# Altium schematic sheet FRONT-UNIT-7.SCHDOC: FRONT-UNIT-7INCH
size A2; DocumentNumber: 1; Revision: 2.0; SheetNumber: 1; SheetTotal: 18; DocumentName: Лист 1.SCHDOC
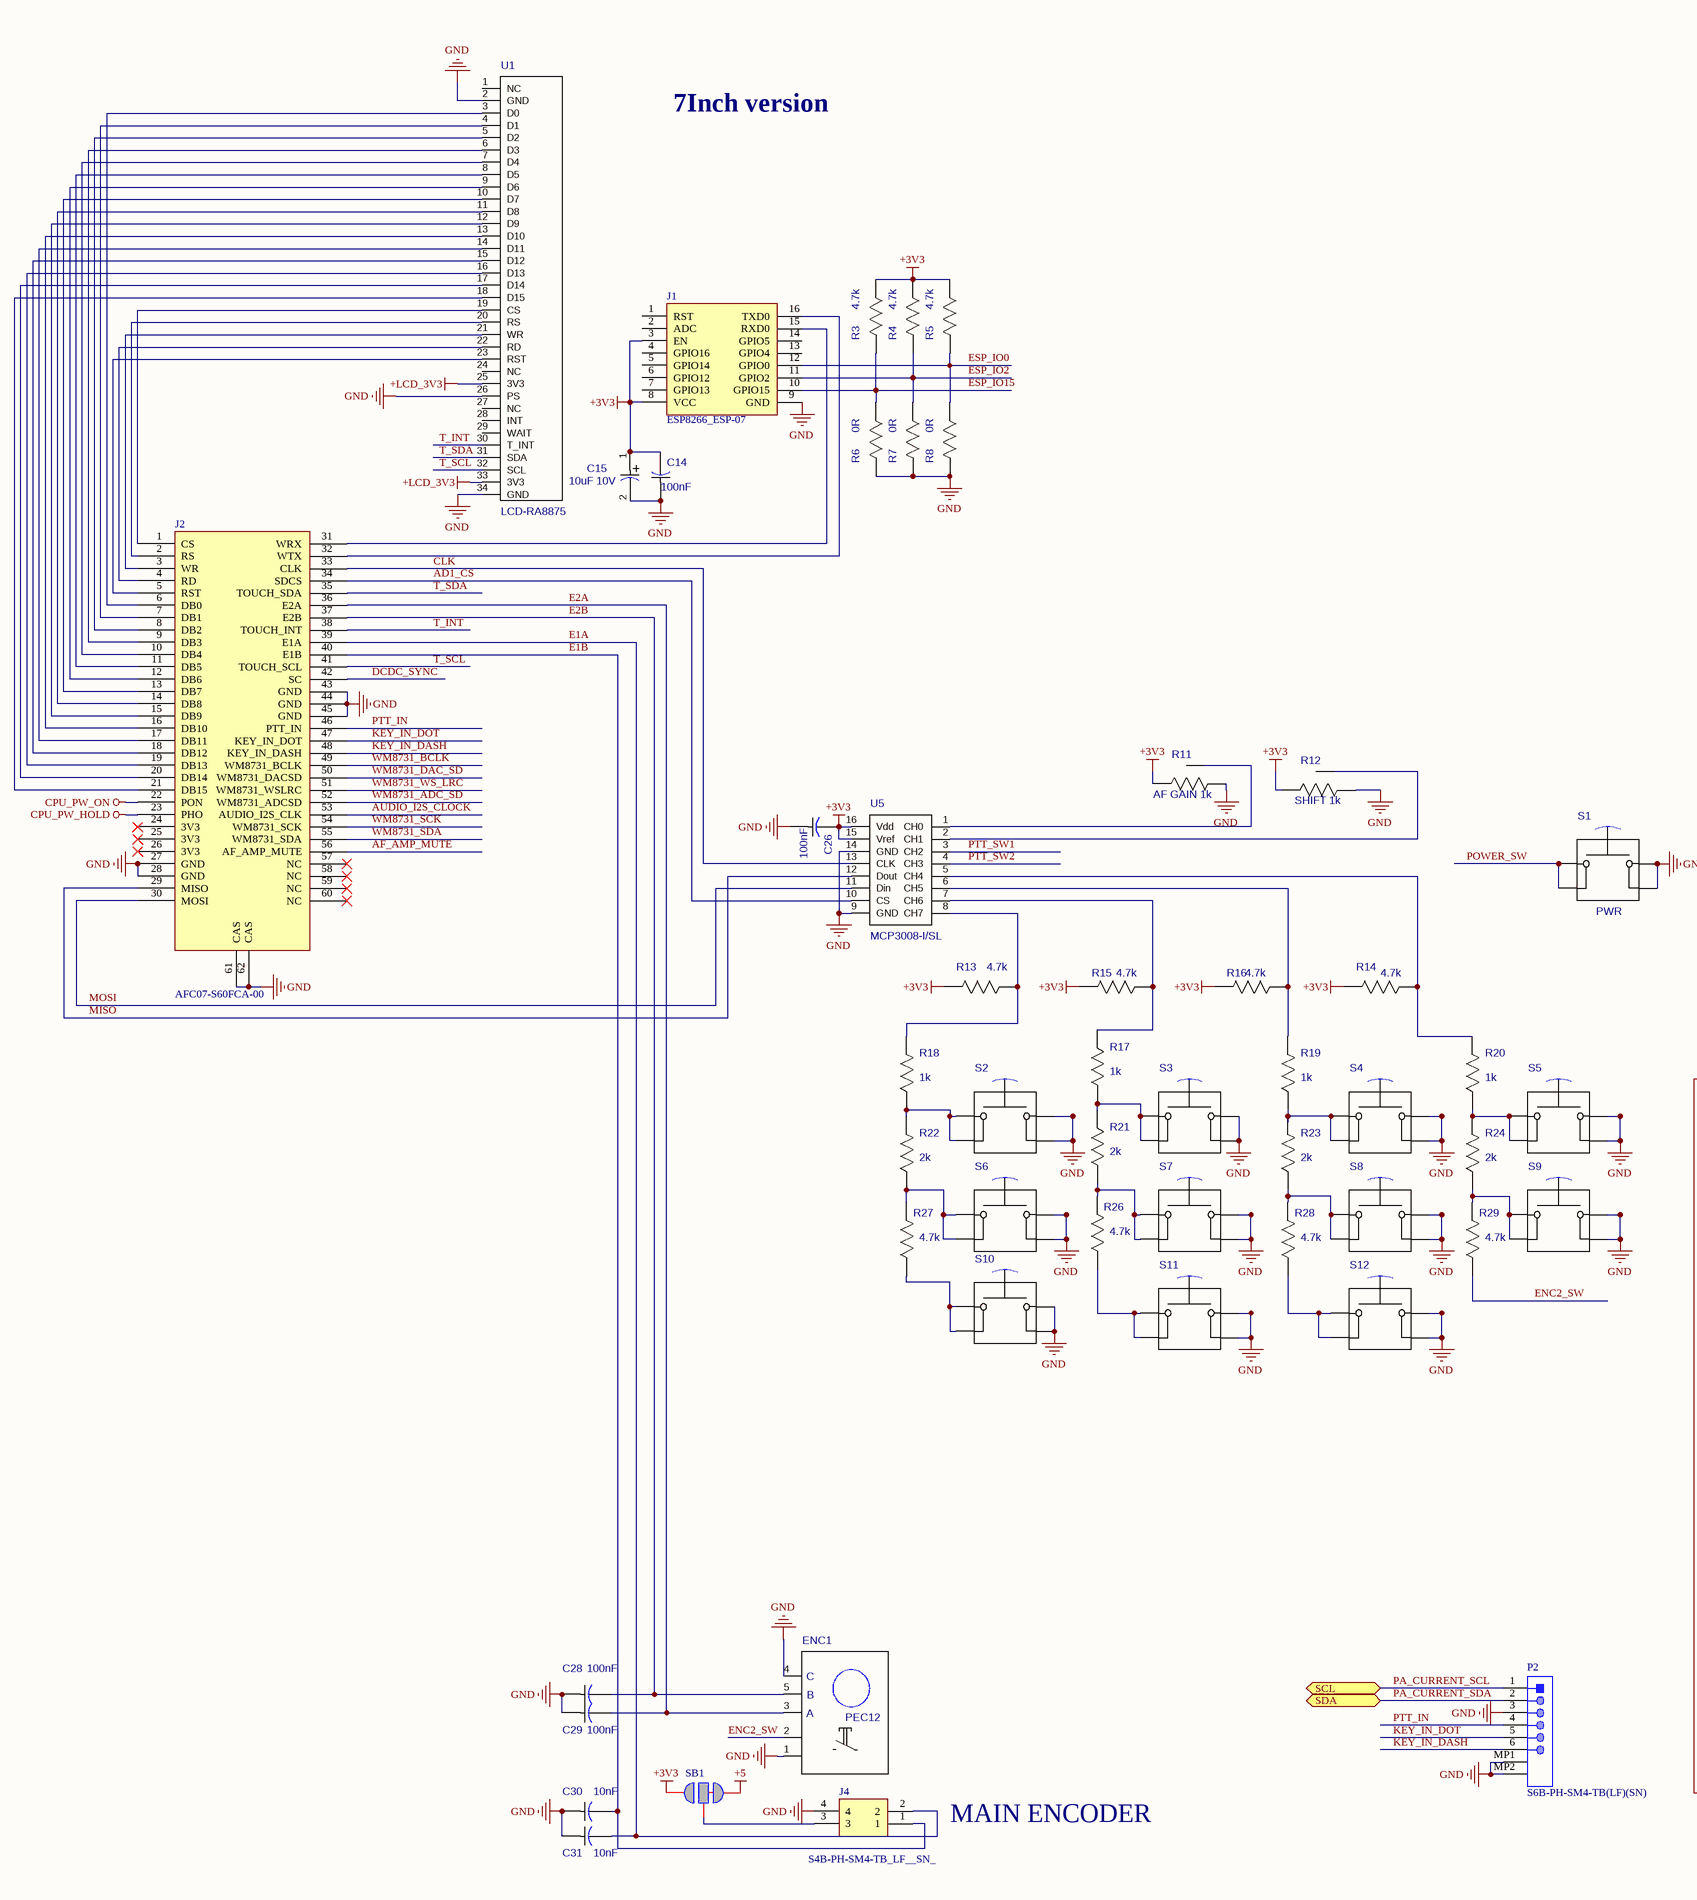
[diagram p0: FRONT-UNIT-7.SCHDOC, left]
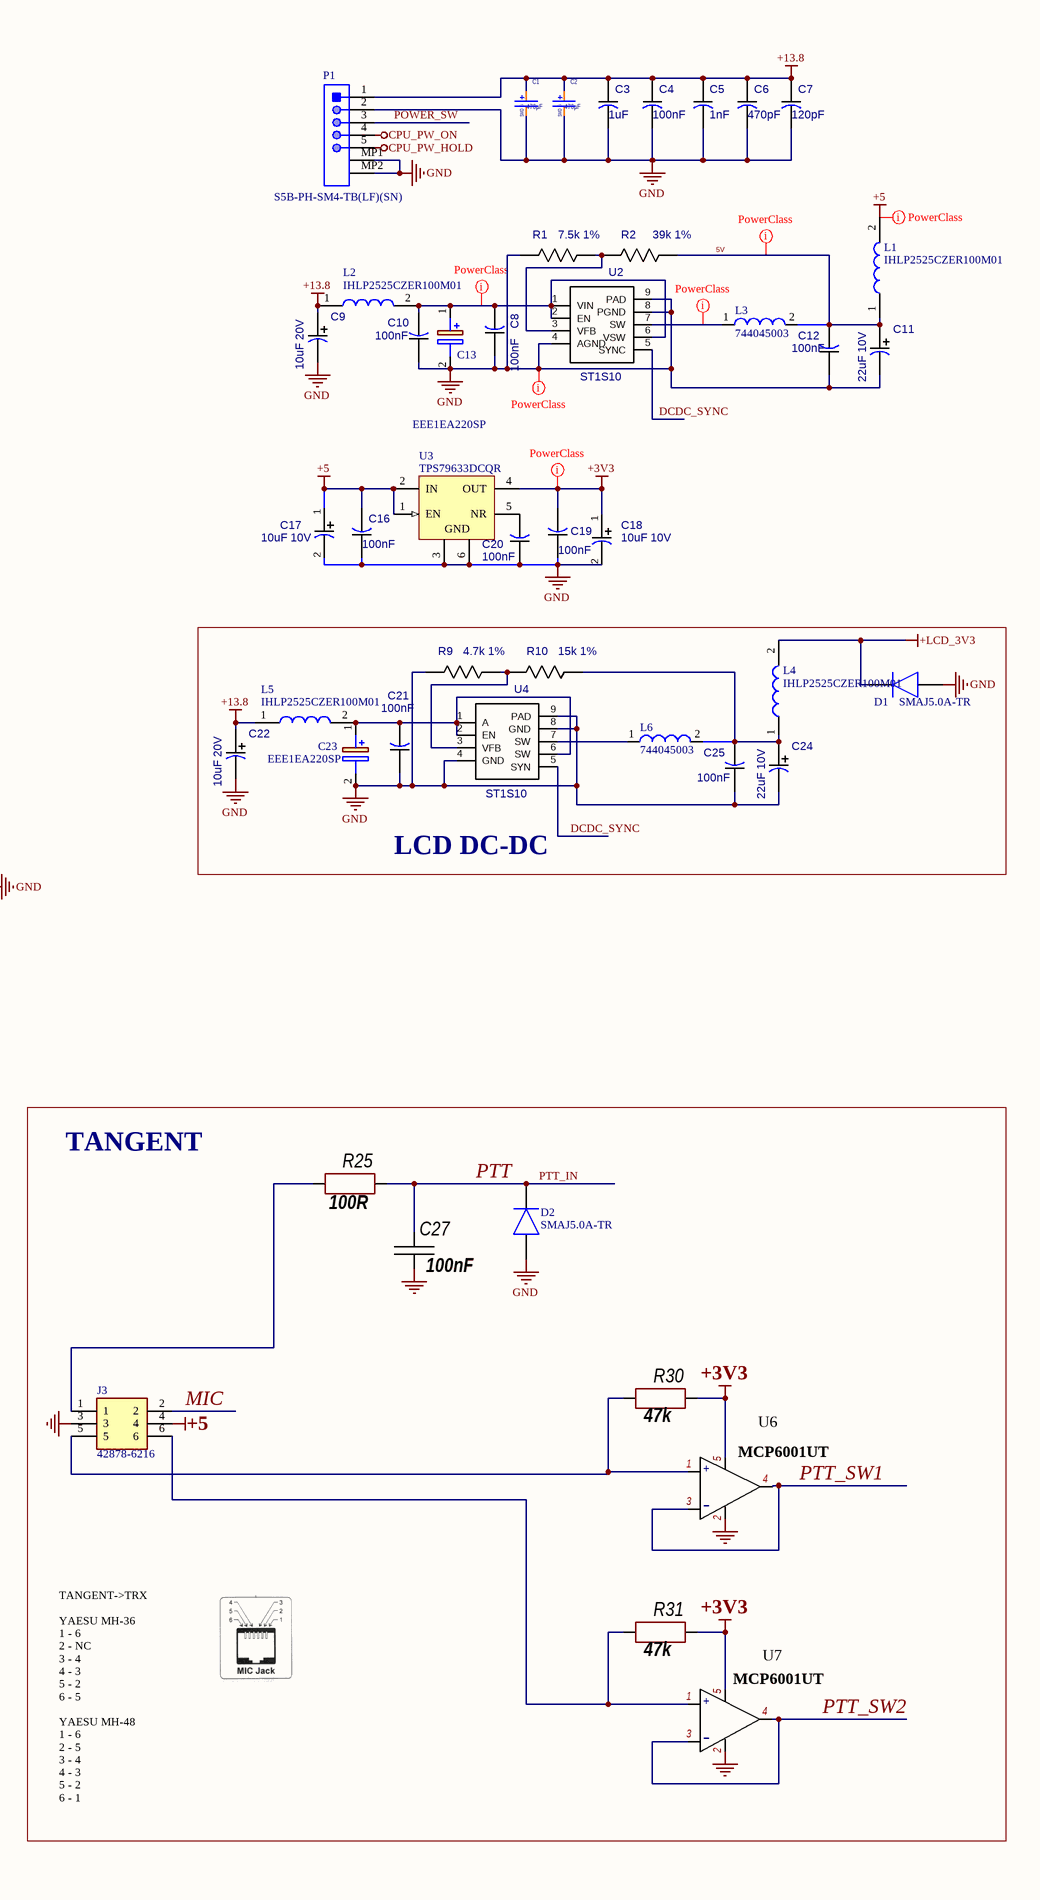
[diagram p1: FRONT-UNIT-7.SCHDOC, right]

## Parts
C1  value 470µF  [SMD-G-10X10.2]  (hidden comment: 470uF 25V)
C2  value 470µF  [SMD-G-10X10.2]  (hidden comment: 470uF 25V)
C3  1uF  [CAP_1206]
C4  100nF  [CAP_1206]
C5  1nF  [CAP_1206]
C6  470pF  [CAP_1206]
C7  120pF  [CAP_1206]
C8  100nF  [CAP_0805]
C9  10uF 20V  [CAPAE_4.3x4.3h5.4]
C10  100nF  [CAP_0805]
C11  22uF 10V  [CAPAE_4.3x4.3h5.4]
C12  100nF  [CAP_0805]
C13  EEE1EA220SP  [EEE1AA101SP]
C14  100nF  [CAP_0805]
C15  10uF 10V  [CAPAE_4.3x4.3h5.4]
C16  100nF  [CAP_0805]
C17  10uF 10V  [CAPAE_4.3x4.3h5.4]
C18  10uF 10V  [CAPAE_4.3x4.3h5.4]
C19  100nF  [CAP_0805]
C20  100nF  [CAP_0805]
C21  100nF  [CAP_0805]
C22  10uF 20V  [CAPAE_4.3x4.3h5.4]
C23  EEE1EA220SP  [EEE1AA101SP]
C24  22uF 10V  [CAPAE_4.3x4.3h5.4]
C25  100nF  [CAP_0805]
C26  100nF  [CAP_0805]
C27  100nF  [CH0805C]
C28  100nF  [CAP_0805]
C29  100nF  [CAP_0805]
C30  10nF  [CAP_0805]
C31  10nF  [CAP_0805]
D1  SMAJ5.0A-TR  [SMBJ36CATR]
D2  SMAJ5.0A-TR  [SMBJ36CATR]
ENC1  PEC12  [PEC12]
J1  ESP8266_ESP-07  [ESP8266ESP07]
J2  AFC07-S60FCA-00  [AFC07-S60FCA-00]
J3  42878-6216  [428786216]
J4  S4B-PH-SM4-TB_LF__SN_  [S4B-PH-SM4-TB]
L1  IHLP2525CZER100M01  [INDPM6965X300N]
L2  IHLP2525CZER100M01  [INDPM6965X300N]
L3  744045003  [WE-LQ-L]
L4  IHLP2525CZER100M01  [INDPM6965X300N]
L5  IHLP2525CZER100M01  [INDPM6965X300N]
L6  744045003  [WE-LQ-L]
P1  S5B-PH-SM4-TB(LF)(SN)  [JST-S5B-PH-SM4-TB_V]
P2  S6B-PH-SM4-TB(LF)(SN)  [JST-S6B-PH-SM4-TB(LF)(SN)_V]
R1  7.5k 1%  [RES_0805]
R2  39k 1%  [RES_0805]
R3  4.7k  [RES_0805]
R4  4.7k  [RES_0805]
R5  4.7k  [RES_0805]
R6  0R  [RES_0805]
R7  0R  [RES_0805]
R8  0R  [RES_0805]
R9  4.7k 1%  [RES_0805]
R10  15k 1%  [RES_0805]
R11  value AF GAIN 1k  [PTV09]  (hidden comment: PTV09A-4030F-A102)
R12  value SHIFT 1k  [PTV09]  (hidden comment: PTV09A-4030F-A102)
R13  4.7k  [RES_0805]
R14  4.7k  [RES_0805]
R15  4.7k  [RES_0805]
R16  4.7k  [RES_0805]
R17  1k  [RES_0805]
R18  1k  [RES_0805]
R19  1k  [RES_0805]
R20  1k  [RES_0805]
R21  2k  [RES_0805]
R22  2k  [RES_0805]
R23  2k  [RES_0805]
R24  2k  [RES_0805]
R25  100R  [CH0805R]
R26  4.7k  [RES_0805]
R27  4.7k  [RES_0805]
R28  4.7k  [RES_0805]
R29  4.7k  [RES_0805]
R30  47k  [CH0805R]
R31  47k  [CH0805C]
S1  value PWR  [PTS645SK50LFS]  (hidden comment: PTS645SK50LFS)
S2  PTS645SK50LFS  [PTS645SK50LFS]  (value not drawn)
S3  PTS645SK50LFS  [PTS645SK50LFS]  (value not drawn)
S4  PTS645SK50LFS  [PTS645SK50LFS]  (value not drawn)
S5  PTS645SK50LFS  [PTS645SK50LFS]  (value not drawn)
S6  PTS645SK50LFS  [PTS645SK50LFS]  (value not drawn)
S7  PTS645SK50LFS  [PTS645SK50LFS]  (value not drawn)
S8  PTS645SK50LFS  [PTS645SK50LFS]  (value not drawn)
S9  PTS645SK50LFS  [PTS645SK50LFS]  (value not drawn)
S10  PTS645SK50LFS  [PTS645SK50LFS]  (value not drawn)
S11  PTS645SK50LFS  [PTS645SK50LFS]  (value not drawn)
S12  PTS645SK50LFS  [PTS645SK50LFS]  (value not drawn)
SB1  Jumper_open_short  [PCBJumperOpenShort]  (value not drawn)  (net tie, no BOM)
U1  LCD-RA8875  [LCD-RA8875]
U2  ST1S10  [ST1S10]
U3  TPS79633DCQR  [DCQ0006A_L]
U4  ST1S10  [ST1S10]
U5  MCP3008-I/SL  [MCP3008-I/SL]
U6  MCP6001UT  [SOT23-5]
U7  MCP6001UT  [SOT23-5]

## Blocks framed on the sheet
LCD DC-DC: C21-C25 D1 L4-L6 R9 R10 U4
TANGENT: C27 D2 J3 R25 R30 R31 U6 U7

## Ports
SCL (bidir), SDA (bidir)

## Nets
+3V3: C14.2 C15.1(PLUS) C18.1(PLUS) C19.2 C26.2 J1.3(EN) J1.8(VCC) R3.1 R4.1 R5.1 R11.1(CW) R12.1(CW) R13.2 R14.2 R15.2 R16.2 R30.2 R31.2 SB1.2 U3.4(OUT) U5.15(Vref) U5.16(Vdd) U6.5 U7.5
+5: C16.2 C17.1(PLUS) J3.4 L1.2 SB1.1 U3.1(EN) U3.2(IN)
+13.8: C1.1 C2.1 C3.1 C4.1 C5.1 C6.1 C7.1 C9.1(PLUS) C22.1(PLUS) L2.1 L5.1 P1.1
+LCD_3V3: D1.1(K) L4.2 U1.25(3V3) U1.33(3V3)
CPU_PW_HOLD: J2.23(PHO) P1.5
CPU_PW_ON: J2.22(PON) P1.4
GND: C1.2 C2.2 C3.2 C4.2 C5.2 C6.2 C7.2 C8.1 C9.2(MINUS) C10.1 C11.2(MINUS) C12.1 C13.2(-) C14.1 C15.2(MINUS) C16.1 C17.2(MINUS) C18.2(MINUS) C19.1 C20.1 C21.1 C22.2(MINUS) C23.2(-) C24.2(MINUS) C25.1 C26.1 C27.1 C28.1 C29.1 C30.1 C31.1 D1.2(A) D2.2(A) ENC1.1 ENC1.4(C) J1.9(GND) J2.27(GND) J2.28(GND) J2.43(GND) J2.44(GND) J2.45(GND) J2.61(CAS) J2.62(CAS) J3.3 J4.4 P1.2 P1.MP1 P1.MP2 P2.3 P2.MP1 P2.MP2 R1.1 R6.2 R7.2 R8.2 R9.1 R11.3(CCW) R12.3(CCW) S1.3(B) S1.4(B) S2.3(B) S2.4(B) S3.3(B) S3.4(B) S4.3(B) S4.4(B) S5.3(B) S5.4(B) S6.3(B) S6.4(B) S7.3(B) S7.4(B) S8.3(B) S8.4(B) S9.3(B) S9.4(B) S10.3(B) S10.4(B) S11.3(B) S11.4(B) S12.3(B) S12.4(B) U1.2(GND) U1.26(PS) U1.34(GND) U2.4(AGND) U2.8(PGND) U2.9(PAD) U3.3(GND) U3.6(GND) U4.4(GND) U4.8(GND) U4.9(PAD) U5.9(GND) U5.14(GND) U6.2 U7.2
5V: C11.1(PLUS) C12.2 L1.1 L3.2 R2.2
AD1_CS: J2.34(SDCS) U5.10(CS)
AF_AMP_MUTE: J2.56(AF_AMP_MUTE)
AUDIO_I2S_CLOCK: J2.53(AUDIO_I2S_CLK)
CLK: J2.33(CLK) U5.13(CLK)
DCDC_SYNC: J2.42(SC) U2.5(SYNC) U4.5(SYN)
E1A: C31.2 J2.39(E1A) J4.2
E1B: C30.2 J2.40(E1B) J4.1
E2A: C29.2 ENC1.3(A) J2.36(E2A)
E2B: C28.2 ENC1.5(B) J2.37(E2B)
ENC2_SW: ENC1.2 R29.1
ESP_IO0: J1.12(GPIO0) R5.2 R8.1
ESP_IO2: J1.11(GPIO2) R4.2 R7.1
ESP_IO15: J1.10(GPIO15) R3.2 R6.1
KEY_IN_DASH: J2.48(KEY_IN_DASH) P2.6
KEY_IN_DOT: J2.47(KEY_IN_DOT) P2.5
MIC: J3.2
MISO: J2.29(MISO) U5.12(Dout)
MOSI: J2.30(MOSI) U5.11(Din)
PA_CURRENT_SCL: P2.1 ; port SCL
PA_CURRENT_SDA: P2.2 ; port SDA
POWER_SW: P1.3 S1.1(A) S1.2(A)
PTT: C27.2 D2.1(K) J2.46(PTT_IN) P2.4 R25.2  [also labelled PTT_IN]
PTT_SW1: U5.3(CH2) U6.3 U6.4
PTT_SW2: U5.4(CH3) U7.3 U7.4
T_INT: J2.38(TOUCH_INT) U1.30(T_INT)
T_SCL: J2.41(TOUCH_SCL) U1.32(SCL)
T_SDA: J2.35(TOUCH_SDA) U1.31(SDA)
WM8731_ADC_SD: J2.52(WM8731_ADCSD)
WM8731_BCLK: J2.49(WM8731_BCLK)
WM8731_DAC_SD: J2.50(WM8731_DACSD)
WM8731_SCK: J2.54(WM8731_SCK)
WM8731_SDA: J2.55(WM8731_SDA)
WM8731_WS_LRC: J2.51(WM8731_WSLRC)
NetC8_2: C8.2 C10.2 C13.1(+) L2.2 U2.1(VIN) U2.2(EN) U2.6(VSW)
NetC20_2: C20.2 U3.5(NR)
NetC21_2: C21.2 C23.1(+) L5.2 U4.1(A) U4.2(EN) U4.6(SW)
NetC24_1: C24.1(PLUS) C25.2 L4.1 L6.2 R10.2
NetJ1_15: J1.15(RXD0) J2.31(WRX)
NetJ1_16: J1.16(TXD0) J2.32(WTX)
NetJ2_1: J2.1(CS) U1.19(CS)
NetJ2_2: J2.2(RS) U1.20(RS)
NetJ2_3: J2.3(WR) U1.21(WR)
NetJ2_4: J2.4(RD) U1.22(RD)
NetJ2_5: J2.5(RST) U1.23(RST)
NetJ2_6: J2.6(DB0) U1.3(D0)
NetJ2_7: J2.7(DB1) U1.4(D1)
NetJ2_8: J2.8(DB2) U1.5(D2)
NetJ2_9: J2.9(DB3) U1.6(D3)
NetJ2_10: J2.10(DB4) U1.7(D4)
NetJ2_11: J2.11(DB5) U1.8(D5)
NetJ2_12: J2.12(DB6) U1.9(D6)
NetJ2_13: J2.13(DB7) U1.10(D7)
NetJ2_14: J2.14(DB8) U1.11(D8)
NetJ2_15: J2.15(DB9) U1.12(D9)
NetJ2_16: J2.16(DB10) U1.13(D10)
NetJ2_17: J2.17(DB11) U1.14(D11)
NetJ2_18: J2.18(DB12) U1.15(D12)
NetJ2_19: J2.19(DB13) U1.16(D13)
NetJ2_20: J2.20(DB14) U1.17(D14)
NetJ2_21: J2.21(DB15) U1.18(D15)
NetJ3_1: J3.1 R25.1
NetJ3_5: J3.5 R30.1 U6.1
NetJ3_6: J3.6 R31.1 U7.1
NetJ4_3: J4.3 SB1.3
NetL3_1: L3.1 U2.7(SW)
NetL6_1: L6.1 U4.7(SW)
NetR1_2: R1.2 R2.1 U2.3(VFB)
NetR9_2: R9.2 R10.1 U4.3(VFB)
NetR11_2: R11.2(W) U5.1(CH0)
NetR12_2: R12.2(W) U5.2(CH1)
NetR13_1: R13.1 R18.2 U5.8(CH7)
NetR14_1: R14.1 R20.2 U5.5(CH4)
NetR15_1: R15.1 R17.2 U5.7(CH6)
NetR16_1: R16.1 R19.2 U5.6(CH5)
NetR17_1: R17.1 R21.2 S3.1(A) S3.2(A)
NetR18_1: R18.1 R22.2 S2.1(A) S2.2(A)
NetR19_1: R19.1 R23.2 S4.1(A) S4.2(A)
NetR20_1: R20.1 R24.2 S5.1(A) S5.2(A)
NetR21_1: R21.1 R26.2 S7.1(A) S7.2(A)
NetR22_1: R22.1 R27.2 S6.1(A) S6.2(A)
NetR23_1: R23.1 R28.2 S8.1(A) S8.2(A)
NetR24_1: R24.1 R29.2 S9.1(A) S9.2(A)
NetR26_1: R26.1 S11.1(A) S11.2(A)
NetR27_1: R27.1 S10.1(A) S10.2(A)
NetR28_1: R28.1 S12.1(A) S12.2(A)

Not connected (* = marked no-connect by the designer): J1 1(RST) 2(ADC) 4(GPIO16) 5(GPIO14) 6(GPIO12) 7(GPIO13) 13(GPIO4) 14(GPIO5); J2 24(3V3)* 25(3V3)* 26(3V3)* 57(NC)* 58(NC)* 59(NC)* 60(NC)*; U1 1(NC) 24(NC) 27(NC) 28(INT) 29(WAIT)

## Layout directives
net class PowerPads: 5V, +3V3, +5, GND, NetC8_2, NetL3_1

## Notes on the sheet
- 7Inch version
- TANGENT->TRX
  YAESU MH-36
  1 - 6
  2 - NC
  3 - 4
  4 - 3
  5 - 2
  6 - 5
  YAESU MH-48
  1 - 6
  2 - 5
  3 - 4
  4 - 3
  5 - 2
  6 - 1
- MAIN ENCODER
- Title
- Size:
- Date:
- File:
- A2
- Number:
- Time:
- Revision:
- Sheet
- of
- (in symbol MCP6001UT_1) +; -
- (in symbol SMD-G 470uF 25V) SMD G

## Library data of the parts
C1 C2 = SMD-G 470uF 25V: CAP ALUM 470UF 20% 25V SMD; Manufacturer: KEMET; Manufacturer PartNumber: EDH477M025A9PAA; Pricing Аlternative: 0.05; Temp.Characteristic: –55 °C to +105 °C; Note: Aluminum Electrolytic Capacitors; Detailed Description: 470µF 25V Aluminum Electrolytic Capacitors Radial, Can - SMD  2000 Hrs @ 105°C; Lifetime @ Temp: 2000Hrs@105℃; ComponentLink2URL: http://www.mouser.com/ds/2/315/ABA0000C1181-947564.pdf; Dealer Digi-Key: https://www.digikey.com/product-detail/en/kemet/EDH477M025A9PAA/EDH477M025A9PAA-ND/6597660; Dealer Аlternative: https://detail.1688.com/offer/541866342432.html; Package / Case: G, 0.394" Dia (10.00mm); Pricing Digi-Key: 0.21; Publisher: Catcatcat Electronics; Tolerance: ±20 %; Voltage: 25V; HelpURL: https://api.kemet.com/component-edge/download/datasheet/EDH477M025A9PAA.pdf; website developer: http://catcatcat.d-lan.dp.ua/; PartNumber Digi-Key: EDH477M025A9PAA; Assembly type: Manual Part
C3-C7 = CAP_1206
  C3: Value: 1uF
  C4: Value: 100nF
  C5: Value: 1nF
C8 C10 C12 C14 C16 C19-C21 C25 C26 C28-C31 = CAP_0805
  C8 C10 C12 C14 C16 C19-C21 C25 C26 C28 C29: Value: 100nF
C9 C11 C15 C17 C18 C22 C24 = CAPAE_4.3x4.3h5.4
  C9 C22: Value: 10uF 20V
  C11 C24: Value: 22uF 10V
  C15 C17 C18: Value: 10uF 10V
C13 C23 = EEE1EA220SP: Capacitor Polarised; Manufacturer_Name: Panasonic; Datasheet Link: http://industrial.panasonic.com/cdbs/www-data/pdf/RDE0000/ABA0000C1145.pdf; Height: 7.8mm; Manufacturer_Part_Number: EEE1EA220SP
C27 = Capacitor: Manufacturer: *; Model: *; HelpURL: *; ComponentKind: *; Value: *
D1 D2 = SMLVT3V3: Diode; Manufacturer_Name: STMicroelectronics; Allied_Number: 70013736; Datasheet Link: http://www.st.com/web/en/resource/technical/document/datasheet/CD00000923.pdf; Height: 2.65mm; Manufacturer_Part_Number: SMLVT3V3; Mouser Part Number: 511-SMLVT3V3; Mouser Price/Stock: https://www.mouser.com/Search/Refine.aspx?Keyword=511-SMLVT3V3; RS Part Number: 5444821P; RS Price/Stock: http://uk.rs-online.com/web/p/products/5444821P; Allied Price/Stock: http://www.alliedelec.com/stmicroelectronics-smlvt3v3/70013736/; LCSC Part #: test
ENC1 = PEC12: FULLNAME: Выключатель замыкающий с приводом нажатием кнопки; Value: PEC12
J1 = ESP8266_ESP-07: Connector; Manufacturer_Name: Ai-Thinker; Manufacturer_Part_Number: ESP8266 ESP-07; Datasheet Link: http://datasheet.octopart.com/ESP-07S-RF-Solutions-datasheet-104506015.pdf; Height: 3mm
J3 = 42878-6216: Connector; Manufacturer_Name: Molex; Datasheet Link: https://www.molex.com/pdm_docs/sd/428786216_sd.pdf; Height: 12.7mm; Manufacturer_Part_Number: 42878-6216; Mouser Part Number: 538-42878-6216; Mouser Price/Stock: https://www.mouser.co.uk/ProductDetail/Molex/42878-6216?qs=yYVs2tXBqMPaSjdPYoO9rg%3D%3D
J4 = S4B-PH-SM4-TB_LF__SN_: Connector; Manufacturer_Name: JST (JAPAN SOLDERLESS TERMINALS); Manufacturer_Part_Number: S4B-PH-SM4-TB(LF)(SN); Datasheet Link: http://uk.rs-online.com/web/p/products/6881366; Arrow Part Number: S4B-PH-SM4-TB(LF)(SN); Arrow Price/Stock: https://www.arrow.com/en/products/s4b-ph-sm4-tb-lf-sn/jst-manufacturing
L1 L2 L4 L5 = IHLP2525CZER100M01: Inductor; Manufacturer_Name: Vishay; Datasheet Link: https://www.vishay.com/docs/34104/ihlp-2525cz-01.pdf; Height: 3mm; Manufacturer_Part_Number: IHLP2525CZER100M01; Mouser Part Number: 70-IHLP2525CZER100M0; Mouser Price/Stock: https://www.mouser.co.uk/ProductDetail/Vishay-Dale/IHLP2525CZER100M01?qs=PA%252BPfIdQ8xl3JLrMc5InbA%3D%3D; Arrow Part Number: IHLP2525CZER100M01; Arrow Price/Stock: https://www.arrow.com/en/products/ihlp2525czer100m01/vishay?region=nac
L3 L6 = CMP-0227-00587-1: SMD-RF-Inductor WE-LQ, L = 3.30 µH; Inductance: 3.30 ÂµH; ComponentLink2URL: http://www.we-online.de/katalog/media/pdf/744045003.pdf; ComponentLink2Description: Datasheet; PackageDescription: Inductor, 2-Leads, Body 4.5 x 3.2 mm; PackageReference: WE-LQ-L; DatasheetVersion: ver 3, Jul-2006; ComponentLink1URL: http://www.we-online.com; ComponentLink1Description: Manufacturer Link; PackageVersion: 2006
P1 = CMP-2000-07026-1: Male Header, Pitch 2 mm, 1 x 5 Position, Height 5.5 mm, -25 to 85 degC, RoHS, Tape and Reel; Manufacturer: JST; No of Positions: 5; Pitch: 2mm; Style/Orientation: RightAngleHeader/Plug; Manufacturer URL: http://www.jst.com/home2.html; Datasheet URL: http://www.jst-mfg.com/product/pdf/eng/ePH.pdf; Termination: Crimp; Mounting Technology: SurfaceMount; Package Reference: S5B-PH-SM4-TB; Type: WiretoBoard; Datasheet Version: 12/2012; Package Description: Male Header, Pitch 2 mm, 1 x 5 Position, Height 5.5 mm
P2 = CMP-2000-07027-1: Male Header, Pitch 2 mm, 1 x 6 Position, Height 5.5 mm, -25 to 85 degC; Manufacturer: JST; Pitch: 2mm; Style/Orientation: RightAngleHeader/Plug; No of Positions: 6; Package Reference: S6B-PH-SM4-TB(LF)(SN); Type: ShroudedHeader; Package Description: Male Header, Pitch 2 mm, 1 x 6 Position, Height 5.5 mm; Mounting Technology: SurfaceMount; Datasheet Version: 11/2008; Termination: Solder; Datasheet URL: https://datasheet.ciiva.com/11747/0900766b80df0d9d-11747278.pdf; Manufacturer URL: http://www.jst.com/home2.html
R1-R10 R13-R24 R26-R29 = RES_0805
  R1: Value: 7.5k 1%
  R2: Value: 39k 1%
  R3-R5 R13-R16: Value: 4.7k
  R6-R8: Value: 0R
R11 R12 = PTV09: Adjustable Resistor PTV09
R25 R30 R31 = Resistor: Manufacturer: *; Model: *; HelpURL: *; ComponentKind: *; Value: *
U3 = CMP-0395-00327-2: Single Output High PSRR LDO, 1 A, Fixed 3.3 V Output, 2.7 to 5.5 V Input, 6-pin SOT-223 (DCQ), -40 to 125 degC, Green (RoHS & no Sb/Br); Manufacturer: Texas Instruments; Accuracy(%): 2; Iout(Max)(A): 1; Vdo(Typ)(mV): 220; SubFamily: Single Channel LDO; Vout Adj(Min)(V): 3.3; Vin(Max)(V): 5.5; Iq(Typ)(mA): 0.26; Vin(Min)(V): 2.7; DatasheetVersion: SLVS351N; ComponentLink2Description: Datasheet; PartNumber: TPS79633DCQR; PackageDescription: 6-Pin Plastic Small Outline, Body 3.5 x 6.5 mm, Pitch 1.27 mm; ComponentLink1Description: Manufacturer URL; ComponentLink2URL: http://www.ti.com/general/docs/lit/getliterature.tsp?genericPartNumber=TPS79633&fileType=pdf; ComponentLink3URL: http://www.ti.com/litv/pdf/mpds098c; Mounting Technology: Surface Mount; Fixed Output Options(V): 3.3; PackageReference: DCQ0006A; ComponentLink1URL: http://www.ti.com/; PackageVersion: 4202109/D; ComponentLink3Description: Package Specification; Vout Adj(Max)(V): 3.3; Eco-Plan: Green (RoHS & no Sb/Br)
U6 U7 = MCP6001UT_1
S1-S12 = PTS645SK50LFS
  S2: LCSC Part #: test
U1 = LCD-RA8875: Value: *
U2 U4 = ST1S10: Value: ST1S10
U5 = MCP3008-I/SL: Value: MCP3008-I/SL